# Altium schematic sheet 11_DDR2.SchDoc: DDR2
size A3; Organization: Lime Microsystems; Address1: Surrey Tech Centre; Address2: Guildford GU2 7YG; Address3: Surrey; Address4: United Kingdom; Revision: SoDeRa-PCI v1.0; SheetNumber: 11; SheetTotal: 15
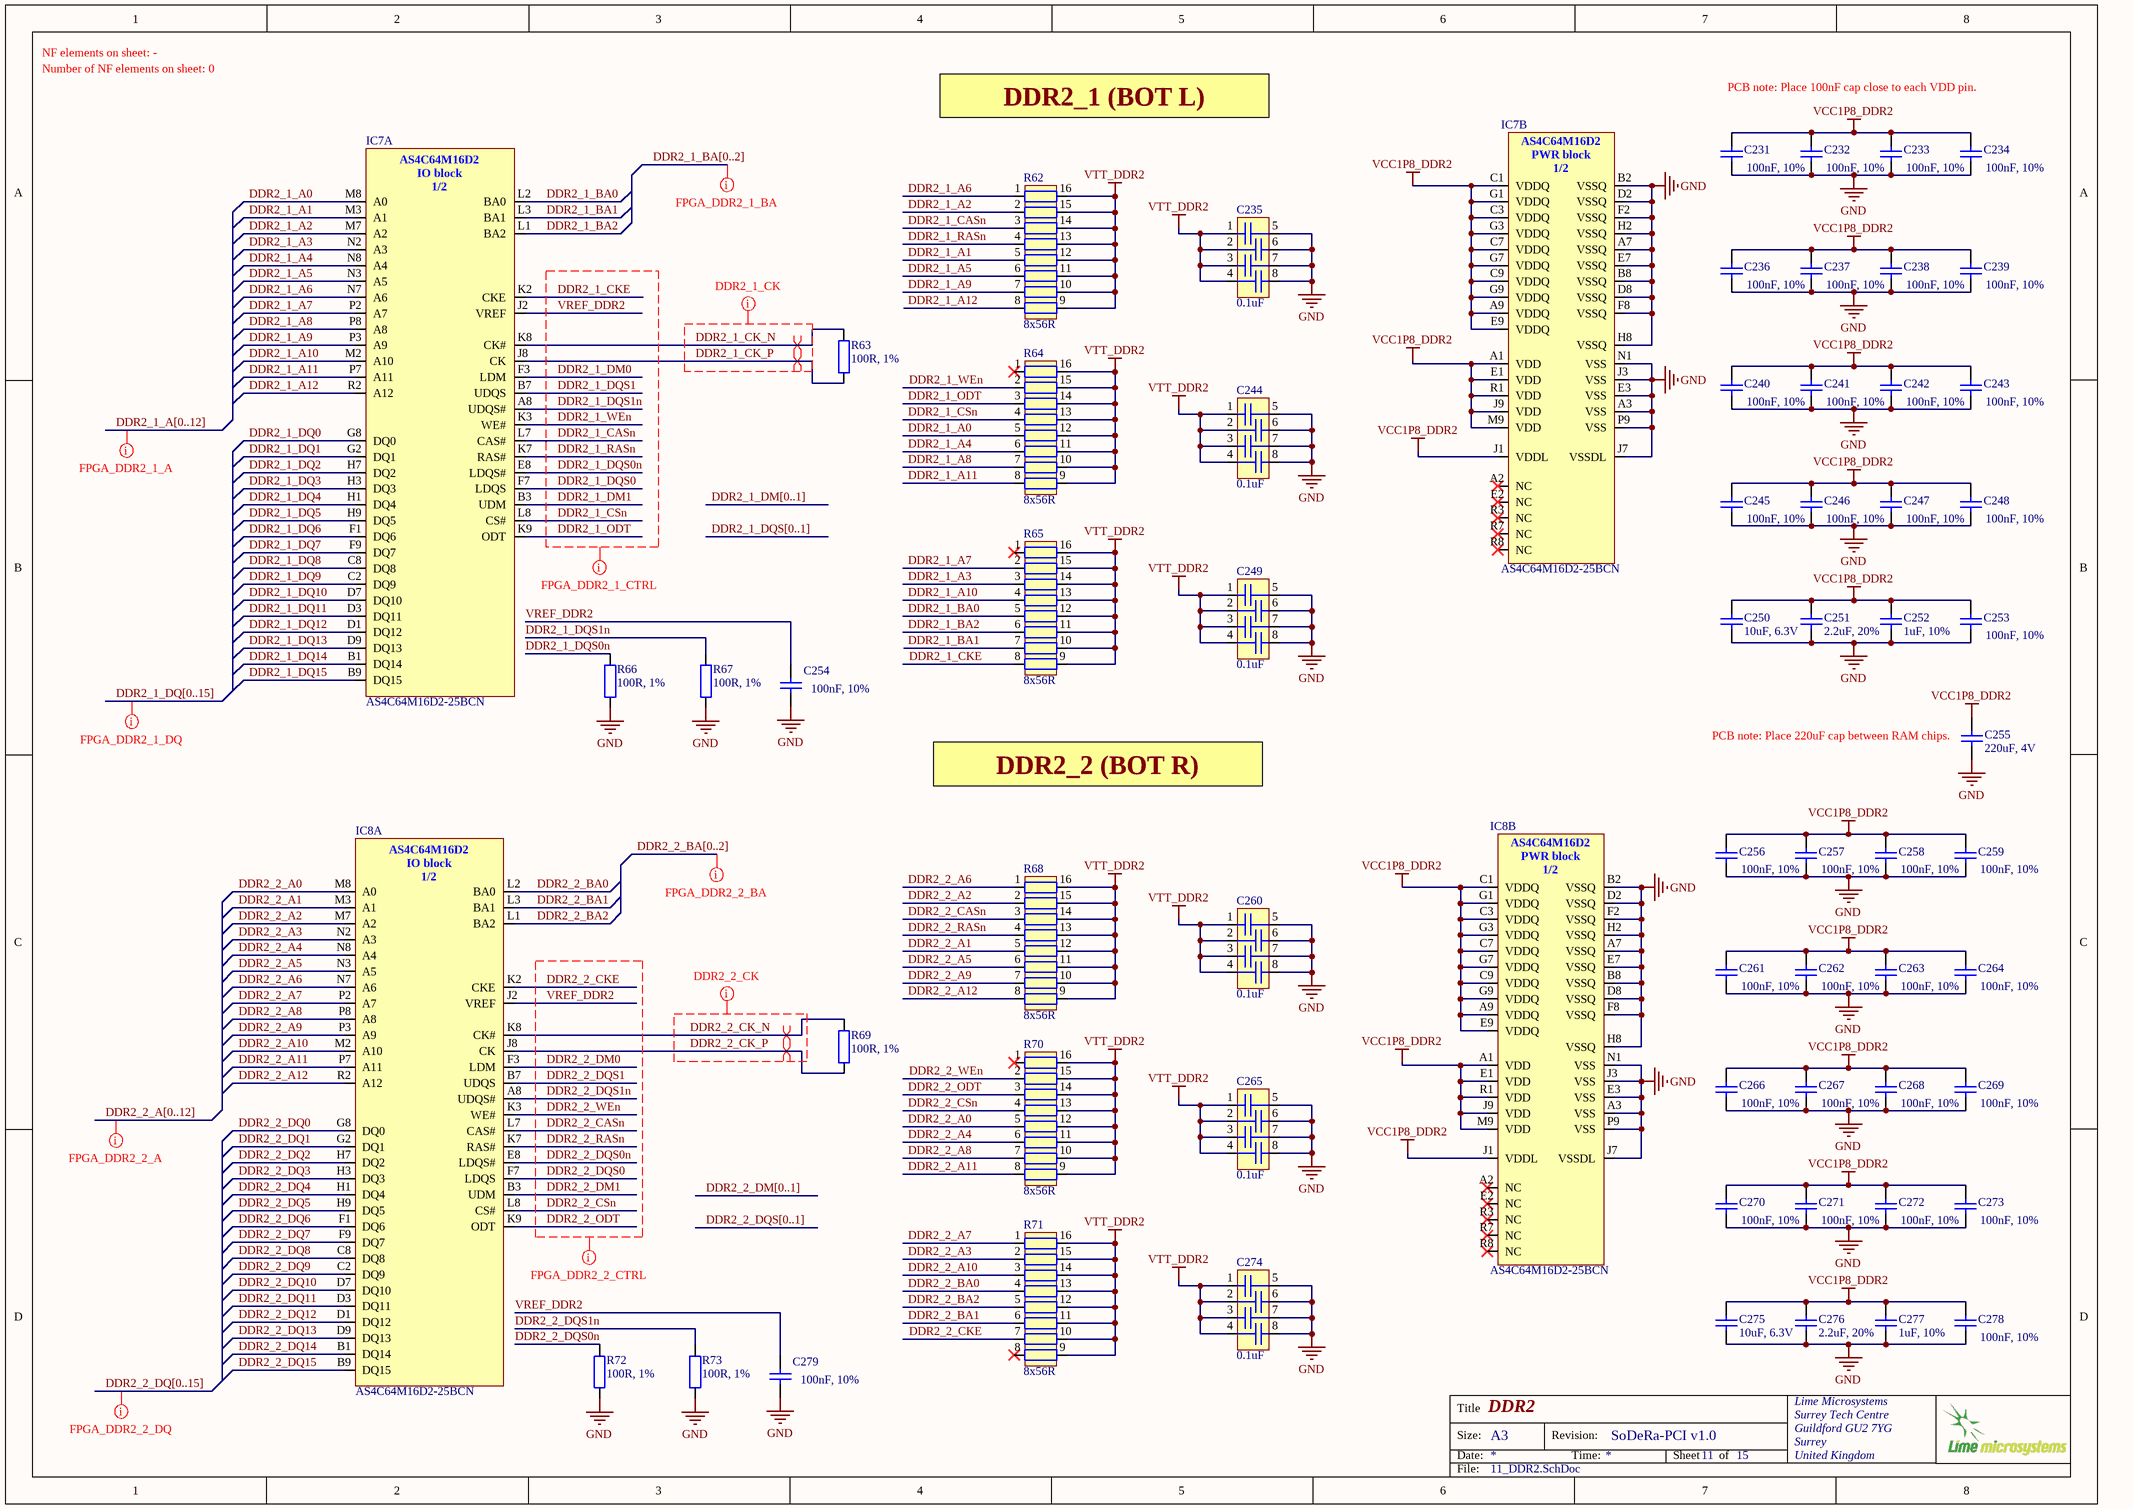
[diagram p0: 11_DDR2.SchDoc]

## Parts
C231  100nF, 10%  [CAP0402]
C232  100nF, 10%  [CAP0402]
C233  100nF, 10%  [CAP0402]
C234  100nF, 10%  [CAP0402]
C235  0.1uF  [CKCA43X7R1C104M100AA]
C236  100nF, 10%  [CAP0402]
C237  100nF, 10%  [CAP0402]
C238  100nF, 10%  [CAP0402]
C239  100nF, 10%  [CAP0402]
C240  100nF, 10%  [CAP0402]
C241  100nF, 10%  [CAP0402]
C242  100nF, 10%  [CAP0402]
C243  100nF, 10%  [CAP0402]
C244  0.1uF  [CKCA43X7R1C104M100AA]
C245  100nF, 10%  [CAP0402]
C246  100nF, 10%  [CAP0402]
C247  100nF, 10%  [CAP0402]
C248  100nF, 10%  [CAP0402]
C249  0.1uF  [CKCA43X7R1C104M100AA]
C250  10uF, 6.3V  [CAP0603]
C251  2.2uF, 20%  [CAP0402]
C252  1uF, 10%  [CAP0402]
C253  100nF, 10%  [CAP0402]
C254  100nF, 10%  [CAP0402]
C255  220uF, 4V  [CAP1206]
C256  100nF, 10%  [CAP0402]
C257  100nF, 10%  [CAP0402]
C258  100nF, 10%  [CAP0402]
C259  100nF, 10%  [CAP0402]
C260  0.1uF  [CKCA43X7R1C104M100AA]
C261  100nF, 10%  [CAP0402]
C262  100nF, 10%  [CAP0402]
C263  100nF, 10%  [CAP0402]
C264  100nF, 10%  [CAP0402]
C265  0.1uF  [CKCA43X7R1C104M100AA]
C266  100nF, 10%  [CAP0402]
C267  100nF, 10%  [CAP0402]
C268  100nF, 10%  [CAP0402]
C269  100nF, 10%  [CAP0402]
C270  100nF, 10%  [CAP0402]
C271  100nF, 10%  [CAP0402]
C272  100nF, 10%  [CAP0402]
C273  100nF, 10%  [CAP0402]
C274  0.1uF  [CKCA43X7R1C104M100AA]
C275  10uF, 6.3V  [CAP0603]
C276  2.2uF, 20%  [CAP0402]
C277  1uF, 10%  [CAP0402]
C278  100nF, 10%  [CAP0402]
C279  100nF, 10%  [CAP0402]
IC7  AS4C64M16D2-25BCN  [AS4C64M16D2]  (parts A,B of 2)
IC8  AS4C64M16D2-25BCN  [AS4C64M16D2]  (parts A,B of 2)
R62  8x56R  [EXB2HV]
R63  100R, 1%  [RES0402]
R64  8x56R  [EXB2HV]
R65  8x56R  [EXB2HV]
R66  100R, 1%  [RES0402]
R67  100R, 1%  [RES0402]
R68  8x56R  [EXB2HV]
R69  100R, 1%  [RES0402]
R70  8x56R  [EXB2HV]
R71  8x56R  [EXB2HV]
R72  100R, 1%  [RES0402]
R73  100R, 1%  [RES0402]

## Nets
GND: C231.2 C232.2 C233.2 C234.2 C235.5 C235.6 C235.7 C235.8 C236.2 C237.2 C238.2 C239.2 C240.2 C241.2 C242.2 C243.2 C244.5 C244.6 C244.7 C244.8 C245.2 C246.2 C247.2 C248.2 C249.5 C249.6 C249.7 C249.8 C250.1 C251.1 C252.1 C253.2 C254.2 C255.1 C256.2 C257.2 C258.2 C259.2 C260.5 C260.6 C260.7 C260.8 C261.2 C262.2 C263.2 C264.2 C265.5 C265.6 C265.7 C265.8 C266.2 C267.2 C268.2 C269.2 C270.2 C271.2 C272.2 C273.2 C274.5 C274.6 C274.7 C274.8 C275.1 C276.1 C277.1 C278.2 C279.2 IC7.A3(VSS) IC7.A7(VSSQ) IC7.B2(VSSQ) IC7.B8(VSSQ) IC7.D2(VSSQ) IC7.D8(VSSQ) IC7.E3(VSS) IC7.E7(VSSQ) IC7.F2(VSSQ) IC7.F8(VSSQ) IC7.H2(VSSQ) IC7.H8(VSSQ) IC7.J3(VSS) IC7.J7(VSSDL) IC7.N1(VSS) IC7.P9(VSS) IC8.A3(VSS) IC8.A7(VSSQ) IC8.B2(VSSQ) IC8.B8(VSSQ) IC8.D2(VSSQ) IC8.D8(VSSQ) IC8.E3(VSS) IC8.E7(VSSQ) IC8.F2(VSSQ) IC8.F8(VSSQ) IC8.H2(VSSQ) IC8.H8(VSSQ) IC8.J3(VSS) IC8.J7(VSSDL) IC8.N1(VSS) IC8.P9(VSS) R66.1 R67.1 R72.1 R73.1
VCC1P8_DDR2: C231.1 C232.1 C233.1 C234.1 C236.1 C237.1 C238.1 C239.1 C240.1 C241.1 C242.1 C243.1 C245.1 C246.1 C247.1 C248.1 C250.2 C251.2 C252.2 C253.1 C255.2 C256.1 C257.1 C258.1 C259.1 C261.1 C262.1 C263.1 C264.1 C266.1 C267.1 C268.1 C269.1 C270.1 C271.1 C272.1 C273.1 C275.2 C276.2 C277.2 C278.1 IC7.A1(VDD) IC7.A9(VDDQ) IC7.C1(VDDQ) IC7.C3(VDDQ) IC7.C7(VDDQ) IC7.C9(VDDQ) IC7.E1(VDD) IC7.E9(VDDQ) IC7.G1(VDDQ) IC7.G3(VDDQ) IC7.G7(VDDQ) IC7.G9(VDDQ) IC7.J1(VDDL) IC7.J9(VDD) IC7.M9(VDD) IC7.R1(VDD) IC8.A1(VDD) IC8.A9(VDDQ) IC8.C1(VDDQ) IC8.C3(VDDQ) IC8.C7(VDDQ) IC8.C9(VDDQ) IC8.E1(VDD) IC8.E9(VDDQ) IC8.G1(VDDQ) IC8.G3(VDDQ) IC8.G7(VDDQ) IC8.G9(VDDQ) IC8.J1(VDDL) IC8.J9(VDD) IC8.M9(VDD) IC8.R1(VDD)
VTT_DDR2: C235.1 C235.2 C235.3 C235.4 C244.1 C244.2 C244.3 C244.4 C249.1 C249.2 C249.3 C249.4 C260.1 C260.2 C260.3 C260.4 C265.1 C265.2 C265.3 C265.4 C274.1 C274.2 C274.3 C274.4 R62.9 R62.10 R62.11 R62.12 R62.13 R62.14 R62.15 R62.16 R64.9 R64.10 R64.11 R64.12 R64.13 R64.14 R64.15 R64.16 R65.9 R65.10 R65.11 R65.12 R65.13 R65.14 R65.15 R65.16 R68.9 R68.10 R68.11 R68.12 R68.13 R68.14 R68.15 R68.16 R70.9 R70.10 R70.11 R70.12 R70.13 R70.14 R70.15 R70.16 R71.9 R71.10 R71.11 R71.12 R71.13 R71.14 R71.15 R71.16
DDR2_1_A0: IC7.M8(A0) R64.5
DDR2_1_A1: IC7.M3(A1) R62.5
DDR2_1_A2: IC7.M7(A2) R62.2
DDR2_1_A3: IC7.N2(A3) R65.3
DDR2_1_A4: IC7.N8(A4) R64.6
DDR2_1_A5: IC7.N3(A5) R62.6
DDR2_1_A6: IC7.N7(A6) R62.1
DDR2_1_A7: IC7.P2(A7) R65.2
DDR2_1_A8: IC7.P8(A8) R64.7
DDR2_1_A9: IC7.P3(A9) R62.7
DDR2_1_A10: IC7.M2(A10) R65.4
DDR2_1_A11: IC7.P7(A11) R64.8
DDR2_1_A12: IC7.R2(A12) R62.8
DDR2_1_BA0: IC7.L2(BA0) R65.5
DDR2_1_BA1: IC7.L3(BA1) R65.7
DDR2_1_BA2: IC7.L1(BA2) R65.6
DDR2_1_CASn: IC7.L7(CAS#) R62.3
DDR2_1_CK_N: IC7.K8(CK#) R63.2
DDR2_1_CK_P: IC7.J8(CK) R63.1
DDR2_1_CKE: IC7.K2(CKE) R65.8
DDR2_1_CSn: IC7.L8(CS#) R64.4
DDR2_1_DM0: IC7.F3(LDM)
DDR2_1_DM1: IC7.B3(UDM)
DDR2_1_DQ0: IC7.G8(DQ0)
DDR2_1_DQ1: IC7.G2(DQ1)
DDR2_1_DQ2: IC7.H7(DQ2)
DDR2_1_DQ3: IC7.H3(DQ3)
DDR2_1_DQ4: IC7.H1(DQ4)
DDR2_1_DQ5: IC7.H9(DQ5)
DDR2_1_DQ6: IC7.F1(DQ6)
DDR2_1_DQ7: IC7.F9(DQ7)
DDR2_1_DQ8: IC7.C8(DQ8)
DDR2_1_DQ9: IC7.C2(DQ9)
DDR2_1_DQ10: IC7.D7(DQ10)
DDR2_1_DQ11: IC7.D3(DQ11)
DDR2_1_DQ12: IC7.D1(DQ12)
DDR2_1_DQ13: IC7.D9(DQ13)
DDR2_1_DQ14: IC7.B1(DQ14)
DDR2_1_DQ15: IC7.B9(DQ15)
DDR2_1_DQS0: IC7.F7(LDQS)
DDR2_1_DQS0n: IC7.E8(LDQS#) R66.2
DDR2_1_DQS1: IC7.B7(UDQS)
DDR2_1_DQS1n: IC7.A8(UDQS#) R67.2
DDR2_1_ODT: IC7.K9(ODT) R64.3
DDR2_1_RASn: IC7.K7(RAS#) R62.4
DDR2_1_WEn: IC7.K3(WE#) R64.2
DDR2_2_A0: IC8.M8(A0) R70.5
DDR2_2_A1: IC8.M3(A1) R68.5
DDR2_2_A2: IC8.M7(A2) R68.2
DDR2_2_A3: IC8.N2(A3) R71.2
DDR2_2_A4: IC8.N8(A4) R70.6
DDR2_2_A5: IC8.N3(A5) R68.6
DDR2_2_A6: IC8.N7(A6) R68.1
DDR2_2_A7: IC8.P2(A7) R71.1
DDR2_2_A8: IC8.P8(A8) R70.7
DDR2_2_A9: IC8.P3(A9) R68.7
DDR2_2_A10: IC8.M2(A10) R71.3
DDR2_2_A11: IC8.P7(A11) R70.8
DDR2_2_A12: IC8.R2(A12) R68.8
DDR2_2_BA0: IC8.L2(BA0) R71.4
DDR2_2_BA1: IC8.L3(BA1) R71.6
DDR2_2_BA2: IC8.L1(BA2) R71.5
DDR2_2_CASn: IC8.L7(CAS#) R68.3
DDR2_2_CK_N: IC8.K8(CK#) R69.2
DDR2_2_CK_P: IC8.J8(CK) R69.1
DDR2_2_CKE: IC8.K2(CKE) R71.7
DDR2_2_CSn: IC8.L8(CS#) R70.4
DDR2_2_DM0: IC8.F3(LDM)
DDR2_2_DM1: IC8.B3(UDM)
DDR2_2_DQ0: IC8.G8(DQ0)
DDR2_2_DQ1: IC8.G2(DQ1)
DDR2_2_DQ2: IC8.H7(DQ2)
DDR2_2_DQ3: IC8.H3(DQ3)
DDR2_2_DQ4: IC8.H1(DQ4)
DDR2_2_DQ5: IC8.H9(DQ5)
DDR2_2_DQ6: IC8.F1(DQ6)
DDR2_2_DQ7: IC8.F9(DQ7)
DDR2_2_DQ8: IC8.C8(DQ8)
DDR2_2_DQ9: IC8.C2(DQ9)
DDR2_2_DQ10: IC8.D7(DQ10)
DDR2_2_DQ11: IC8.D3(DQ11)
DDR2_2_DQ12: IC8.D1(DQ12)
DDR2_2_DQ13: IC8.D9(DQ13)
DDR2_2_DQ14: IC8.B1(DQ14)
DDR2_2_DQ15: IC8.B9(DQ15)
DDR2_2_DQS0: IC8.F7(LDQS)
DDR2_2_DQS0n: IC8.E8(LDQS#) R72.2
DDR2_2_DQS1: IC8.B7(UDQS)
DDR2_2_DQS1n: IC8.A8(UDQS#) R73.2
DDR2_2_ODT: IC8.K9(ODT) R70.3
DDR2_2_RASn: IC8.K7(RAS#) R68.4
DDR2_2_WEn: IC8.K3(WE#) R70.2
VREF_DDR2: C254.1 C279.1 IC7.J2(VREF) IC8.J2(VREF)

Not connected (* = marked no-connect by the designer): IC7 A2(NC)* E2(NC)* R3(NC)* R7(NC)* R8(NC)*; IC8 A2(NC)* E2(NC)* R3(NC)* R7(NC)* R8(NC)*; R64 1*; R65 1*; R70 1*; R71 8*

## Buses and harness runs
bus DDR2_1_A[0..12]
bus DDR2_1_BA[0..2]
bus DDR2_1_DM[0..1]
bus DDR2_1_DQ[0..15]
bus DDR2_1_DQS[0..1]
bus DDR2_2_A[0..12]
bus DDR2_2_BA[0..2]
bus DDR2_2_DM[0..1]
bus DDR2_2_DQ[0..15]
bus DDR2_2_DQS[0..1]

## Layout directives
net class FPGA_DDR0_DQ: (no net found under the mark)
net class FPGA_DDR0_BA: (no net found under the mark)
net class FPGA_DDR0_CTRL: DDR2_1_CASn, DDR2_1_CKE, DDR2_1_CSn, DDR2_1_DM0, DDR2_1_DM1, DDR2_1_DQS0, DDR2_1_DQS0n, DDR2_1_DQS1, DDR2_1_DQS1n, DDR2_1_ODT, DDR2_1_RASn, DDR2_1_WEn, VREF_DDR2
net class FPGA_DDR0_A: (no net found under the mark)
net class FPGA_DDR1_DQ: (no net found under the mark)
net class FPGA_DDR1_BA: (no net found under the mark)
net class FPGA_DDR1_CTRL: DDR2_2_CASn, DDR2_2_CKE, DDR2_2_CSn, DDR2_2_DM0, DDR2_2_DM1, DDR2_2_DQS0, DDR2_2_DQS0n, DDR2_2_DQS1, DDR2_2_DQS1n, DDR2_2_ODT, DDR2_2_RASn, DDR2_2_WEn, VREF_DDR2
net class FPGA_DDR1_A: (no net found under the mark)
differential pair: DDR2_1_CK_N, DDR2_1_CK_P, DDR2_2_CK_N, DDR2_2_CK_P
net class DDR2_2_CK: DDR2_2_CK_N, DDR2_2_CK_P
net class DDR2_1_CK: DDR2_1_CK_N, DDR2_1_CK_P

## Notes on the sheet
- Number of NF elements on sheet: 0
- NF elements on sheet: -
- DDR2_1 (BOT L)
- PCB note: Place 100nF cap close to each VDD pin.
- DDR2_2 (BOT R)
- (near C255) PCB note: Place 220uF cap between RAM chips.
- Title
- Size:
- Date:
- A3
- Revision:
- Time:
- Sheet
- of
- File:
- (in symbol AS4C64M16D2-25BCN, part A) AS4C64M16D2 / IO block / 1/2
- (in symbol AS4C64M16D2-25BCN, part B) AS4C64M16D2 / PWR block / 1/2

## Library data of the parts
C231-C234 C236-C243 C245-C248 C253 C254 C256-C259 C261-C264 C266-C273 C278 C279 = Cap_0603: Manufacturer: Murata; Manufacturer Part Number 1: GRM155R71C104KA88D; Brand: Murata Electronics; Type: General Purpose MLCC; Capacitance: 0.1 uF; Temperature Coefficient / Code: +/- 15 %; Voltage Rating DC: 16 V; Supplier 1: Mouser; Supplier Part Number 1: 81-GRM155R71C104KA88; Tolerance: 10 %; Case Code - in: 0402; Category: Multilayer Ceramic Capacitors MLCC - SMD/SMT; Value: 100nF, 10%; Manufacturer Part Number: GRM155R71C104KA88D
C235 C244 C249 C260 C265 C274 = 4X_cap_array_1206: Manufacturer: TDK; Case Height: 1 mm; Case Length: 3.2 mm; Case Width: 1.6 mm; Voltage Rating: 16 V; Number of Elements: 4; Tolerance: 20 %; Temperature Coefficient / Code: X7R; Value: 0.1uF; Supplier 1: Mouser; Supplier Part Number 1: 810-CKCA43X7R1C104M; RoHS: RoHS Compliant; Termination Style: SMD/SMT; Brand: TDK; Category: Capacitor Arrays & Networks; Product: Ceramic Capacitor Arrays; Series: CKC; Packaging: Reel; Operating Temperature Range: - 55 C to + 125 C; Manufacturer Part Number 1: CKCA43X7R1C104M100AA; Capacitance: 0.1 uF; Product Category: Capacitor Arrays; Standard Pack Qty: 2000; RoHS - Mouser: Y; Minimum Order Quantity: 1; Reeling: True
C250 C275 = Cap_0603: Manufacturer Part Number 1: CC0603MRX5R5BB106; Capacitance: 10µF; Tolerance: ±20%; Supplier 1: Digi-Key; Supplier Part Number 1: 311-1448-2-ND; Package / Case: 0603 (1608 Metric); Category: Capacitors; Voltage - Rated: 6.3V; Value: 10uF, 6.3V
C251 C276 = Cap_0402: Manufacturer Part Number 1: C1005X5R1C225K050BC; Manufacturer: TDK Corporation; Voltage - Rated: 16V; Temperature Coefficient: X5R; Capacitance: 2.2µF; Value: 2.2uF, 20%; Supplier 1: Digi-Key; Supplier Part Number 1: 445-9085-1-ND; Category: Capacitors; Thickness (Max): 0.022" (0.55mm); Applications: General Purpose; Package / Case: 0402 (1005 Metric); Size / Dimension: 0.039" L x 0.020" W (1.00mm x 0.50mm); Features: -; Mounting Type: Surface Mount, MLCC; Ratings: -; Lead Style: -; Operating Temperature: -55°C ~ 85°C; Lead Spacing: -; RoHS: RoHS Compliant; Height - Seated (Max): -; Tolerance: ±20%; Packaging: Tape & Reel (TR)
C252 C277 = Cap_0402: Manufacturer Part Number 1: GRM155R61A105KE15J; Manufacturer: TDK; Voltage Rating: 10; Product Range: TDK - C Series; Ceramic Capacitor Case: 0402 [1005 Metric]; Capacitance: 1; Dielectric Characteristic: X6; Value: 1uF, 10%; Supplier 1: Newark; Supplier Part Number 1: 490-6298-2-ND; Capacitance Tolerance: ± 10%; MSL: -; RoHS: YES
C255 = Cap_1206: Manufacturer Part Number: GRM31CR60G227ME11L; Manufacturer: Murata Electronics North America; Capacitance: 220µF; Temperature Coefficient: X5R; Tolerance: ±20%; Package / Case: 1206 (3216 Metric); Supplier 1: Digi-Key; Packaging: Cut Tape (CT); Size / Dimension: 0.126" L x 0.063" W (3.20mm x 1.60mm); Operating Temperature: -55°C ~ 85°C; Voltage - Rated: 4V; Mounting Type: Surface Mount, MLCC; Ratings: -; Supplier Part Number 1: 490-9774-1-ND; Category: Capacitors; Lead Spacing: -; Lead Style: -; Applications: General Purpose; Features: -; Height - Seated (Max): -; Thickness (Max): 0.075" (1.90mm); RoHS: RoHS Compliant; Value: 220uF, 4V
IC7 IC8 = AS4C64M16D2-25BCN: Manufacturer: Alliance Memory, Inc.; Speed: 400MHz; Interface: Parallel; Memory Type: DDR2 SDRAM; Memory Size: 1G (64M x 16); Voltage - Supply: 1.7 V ~ 1.9 V; Format - Memory: RAM; Supplier 1: Digi-Key; Package / Case: 84-TFBGA; Supplier Device Package: 84-FBGA (8x12.5); Manufacturer Part Number 1: AS4C64M16D2-25BCN; RoHS: RoHS Compliant; Operating Temperature: 0°C ~ 70°C; Category: Integrated Circuits (ICs); Packaging: Tray; Supplier Part Number 1: 1450-1158-ND
R62 R64 R65 R68 R70 R71 = 8X_resistor_array_0402: Manufacturer Part Number 1: EXB2HV560JV; Manufacturer: PANASONIC ELECTRONIC COMPONENTS; Supplier 1: Farnell; Supplier Part Number 1: 2060070; RoHS: YES
R63 R66 R67 R69 R72 R73 = Res_0402: Manufacturer Part Number 1: RMCF0402FT100R; Temperature Coefficient: ±100ppm/°C; Supplier 1: Digi-Key; Supplier Part Number 1: RMCF0402FT100RDKR-ND; Package / Case: 0402 (1005 Metric); Composition: Thick Film; Category: Resistors; Tolerance: ±1%; Value: 100R, 1%